# Altium schematic sheet leo_IMU.SchDoc
size Letter; SheetNumber: 4; SheetTotal: 5
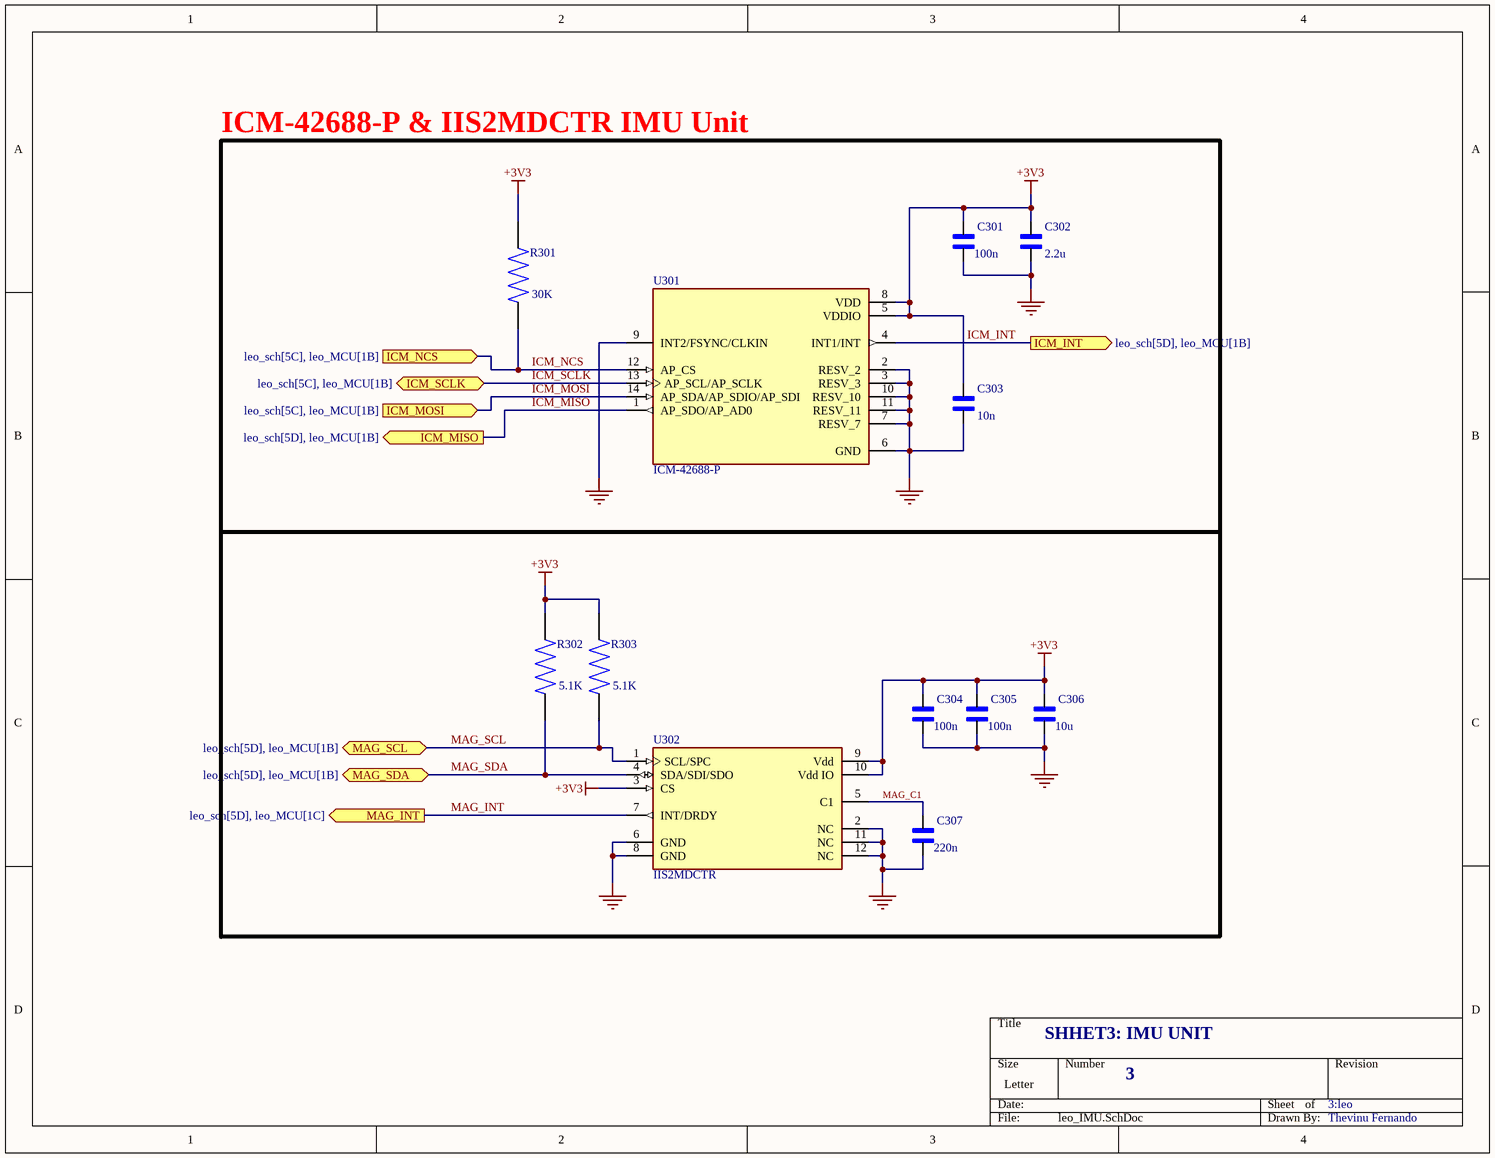
[diagram p0: leo_IMU.SchDoc]

## Parts
C301  100n  [CAP_0402]
C302  2.2u  [CAP_0603]
C303  10n  [CAP_0402]
C304  100n  [CAP_0402]
C305  100n  [CAP_0402]
C306  10u  [CAP_0805]
C307  220n  [CAP_0402]
R301  30K  [RES_0402]
R302  5.1K  [RES_0402]
R303  5.1K  [RES_0402]
U301  ICM-42688-P  [PQFN50P300X250X97-14N]
U302  IIS2MDCTR  [FP-LGA-12-DM00170568-MFG]

## Blocks framed on the sheet
ICM-42688-P & IIS2MDCTR IMU Unit: C301-C307 R301-R303 U301 U302

## Ports
ICM_INT (out, see leo_sch[5D], leo_MCU[1B]), ICM_MISO (out, see leo_sch[5D], leo_MCU[1B]), ICM_MOSI (in, see leo_sch[5C], leo_MCU[1B]), ICM_NCS (in, see leo_sch[5C], leo_MCU[1B]), ICM_SCLK (bidir, see leo_sch[5C], leo_MCU[1B]), MAG_INT (out, see leo_sch[5D], leo_MCU[1C]), MAG_SCL (bidir, see leo_sch[5D], leo_MCU[1B]), MAG_SDA (bidir, see leo_sch[5D], leo_MCU[1B])

## Nets
+3V3: C301.2 C302.2 C303.2 C304.2 C305.2 C306.1 R301.2 R302.2 R303.2 U301.5(VDDIO) U301.8(VDD) U302.3(CS) U302.9(Vdd) U302.10(Vdd_IO)
GND: C301.1 C302.1 C303.1 C304.1 C305.1 C306.2 C307.1 U301.2(RESV_2) U301.3(RESV_3) U301.6(GND) U301.7(RESV_7) U301.9(INT2/FSYNC/CLKIN) U301.10(RESV_10) U301.11(RESV_11) U302.2(NC) U302.6(GND) U302.8(GND) U302.11(NC) U302.12(NC)
ICM_INT: U301.4(INT1/INT) ; port ICM_INT
ICM_MISO: U301.1(AP_SDO/AP_AD0) ; port ICM_MISO
ICM_MOSI: U301.14(AP_SDA/AP_SDIO/AP_SDI) ; port ICM_MOSI
ICM_NCS: R301.1 U301.12(AP_CS) ; port ICM_NCS
ICM_SCLK: U301.13(AP_SCL/AP_SCLK) ; port ICM_SCLK
MAG_C1: C307.2 U302.5(C1)
MAG_INT: U302.7(INT/DRDY) ; port MAG_INT
MAG_SCL: R303.1 U302.1(SCL/SPC) ; port MAG_SCL
MAG_SDA: R302.1 U302.4(SDA/SDI/SDO) ; port MAG_SDA

## Notes on the sheet
- SHHET3: IMU UNIT
- 3
- 3:leo
- Thevinu Fernando

## Library data of the parts
C301 C303-C305 C307 = CAP_0402: Ceramic Capacitor X7R 0402 (1005 Metric); MF: Samsung; MP: CL05B104KO5NNNC; SnapEDA_Link: https://www.snapeda.com/parts/CL05B104KO5NNNC/Samsung/view-part/?ref=snap; Package: SMD-2 Samsung; Value: *; Check_prices: https://www.snapeda.com/parts/CL05B104KO5NNNC/Samsung/view-part/?ref=eda
C302 = CAP_0603: Ceramic Capacitor X5R 0603 (1608 Metric); MF: Samsung Electro-Mechanics; MP: CL10A475KO8NNNC; SnapEDA_Link: https://www.snapeda.com/parts/CL10A475KO8NNNC/Samsung/view-part/?ref=snap; Package: SMD-2 Samsung; Value: *; Check_prices: https://www.snapeda.com/parts/CL10A475KO8NNNC/Samsung/view-part/?ref=eda
C306 = CAP_0805: Ceramic Capacitor X7R 0805 (2012 Metric); MF: Samsung Electro-Mechanics; MP: CL21B106KOQNNNE; SnapEDA_Link: https://www.snapeda.com/parts/CL21B106KOQNNNE/Samsung+Electro-Mechanics/view-part/?ref=snap; Package: 0805 Samsung; Value: *; Check_prices: https://www.snapeda.com/parts/CL21B106KOQNNNE/Samsung+Electro-Mechanics/view-part/?ref=eda
R301-R303 = RES_0402: Chip Resistor 0402 (1005 Metric) Automotive AEC-Q200 Thick Film; MF: Panasonic; MP: ERJ-2RKF1002X; Package: 1005-2 Panasonic; Price: None; Check_prices: https://www.snapeda.com/parts/ERJ-2RKF1002X/Panasonic%20Electronic%20Components/view-part/78636/?ref=eda; Value: *; SnapEDA_Link: https://www.snapeda.com/parts/ERJ-2RKF1002X/Panasonic%20Electronic%20Components/view-part/78636/?ref=snap; Availability: In Stock
U301 = ICM-42688-P: Accelerometer, Gyroscope, 6 Axis Sensor Output; Package: None; MP: ICM-42688-P; Value: *; Availability: Unavailable; Price: None
U302 = IIS2MDCTR: High-accuracy, ultra-low-power, 3-axis digital output magnetometer; Axis: X, Y, Z; Output Type: SPI; Sensing Method: Magnetoresistive; Resolution: 16b; Case/Package: LGA; Min Operating Temperature: -40°C; Packaging: Cut Tape; Number of Pins: 12; Max Operating Temperature: 85°C; RoHS Compliant: Yes